# EAGLE design B602A (EAGLE 6.6.0)
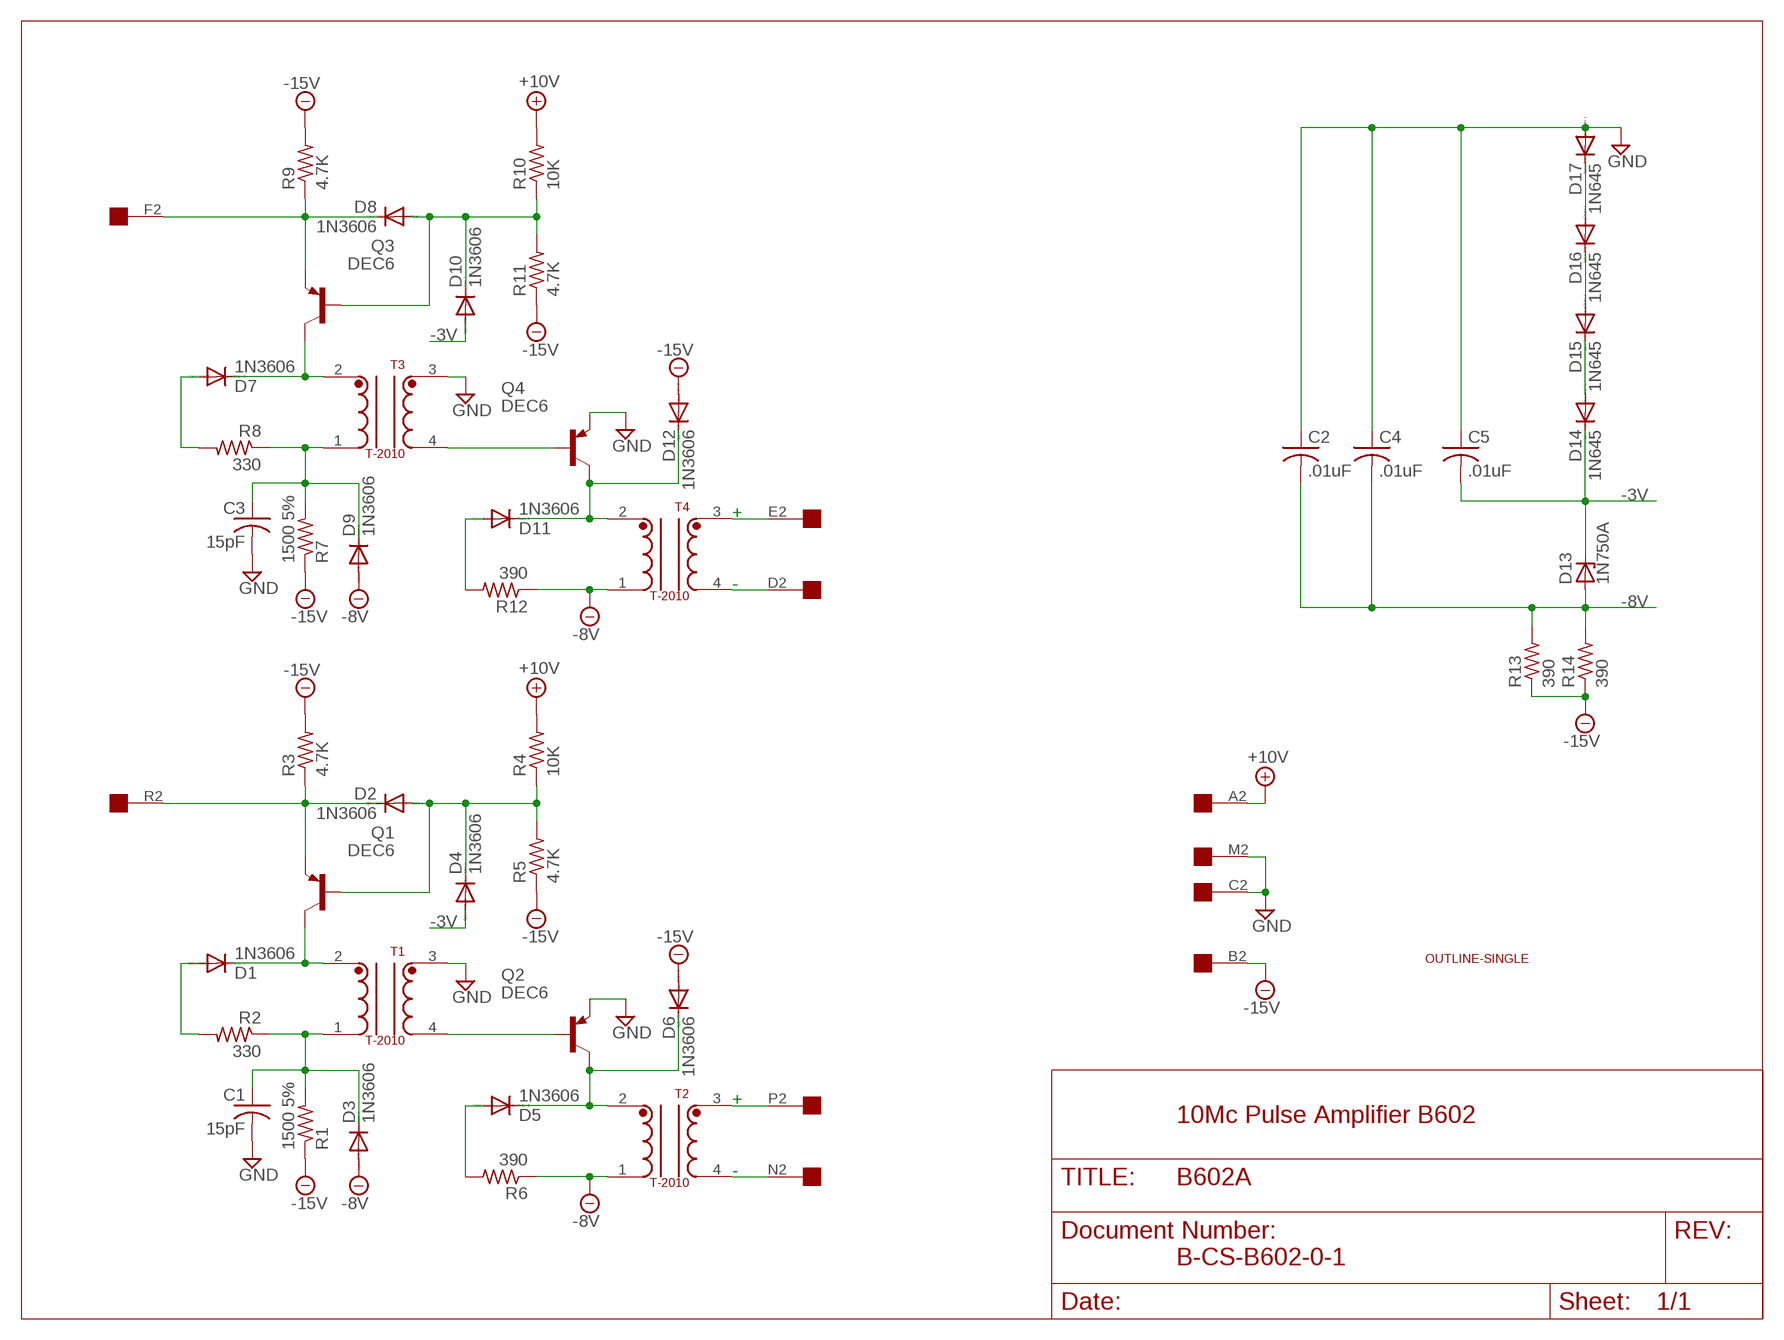
[diagram p0: schematic, sheet 1]

## Parts
C1  15pF  C-US050-025X075  [C050-025X075]
C2  .01uF  C-US050-025X075  [C050-025X075]
C3  15pF  C-US050-025X075  [C050-025X075]
C4  .01uF  C-US050-025X075  [C050-025X075]
C5  .01uF  C-US050-025X075  [C050-025X075]
D1  1N3606  1N4148DO35-10  [DO35-10]
D2  1N3606  1N4148DO35-10  [DO35-10]
D3  1N3606  1N4148DO35-10  [DO35-10]
D4  1N3606  1N4148DO35-10  [DO35-10]
D5  1N3606  1N4148DO35-10  [DO35-10]
D6  1N3606  1N4148DO35-10  [DO35-10]
D7  1N3606  1N4148DO35-10  [DO35-10]
D8  1N3606  1N4148DO35-10  [DO35-10]
D9  1N3606  1N4148DO35-10  [DO35-10]
D10  1N3606  1N4148DO35-10  [DO35-10]
D11  1N3606  1N4148DO35-10  [DO35-10]
D12  1N3606  1N4148DO35-10  [DO35-10]
D13  1N750A  ZENER-DIODEDO35Z10  [DO35Z10]
D14  1N645  1N4148DO35-10  [DO35-10]
D15  1N645  1N4148DO35-10  [DO35-10]
D16  1N645  1N4148DO35-10  [DO35-10]
D17  1N645  1N4148DO35-10  [DO35-10]
Q1  DEC6  2N2904  [TO39]
Q2  DEC6  2N2904  [TO39]
Q3  DEC6  2N2904  [TO39]
Q4  DEC6  2N2904  [TO39]
R1  1500 5%  R-US_0207/10  [0207/10]
R2  330  R-US_0207/10  [0207/10]
R3  4.7K  R-US_0207/10  [0207/10]
R4  10K  R-US_0207/10  [0207/10]
R5  4.7K  R-US_0207/10  [0207/10]
R6  390  R-US_0207/10  [0207/10]
R7  1500 5%  R-US_0207/10  [0207/10]
R8  330  R-US_0207/10  [0207/10]
R9  4.7K  R-US_0207/10  [0207/10]
R10  10K  R-US_0207/10  [0207/10]
R11  4.7K  R-US_0207/10  [0207/10]
R12  390  R-US_0207/10  [0207/10]
R13  390  R-US_0207/10  [0207/10]
R14  390  R-US_0207/10  [0207/10]
T1  T-2010  [TRANSFORMER2]
T2  T-2010  [TRANSFORMER2]
T3  T-2010  [TRANSFORMER2]
T4  T-2010  [TRANSFORMER2]
U$1  OUTLINE-SINGLE  [SINGLE]
U$2  EDGE-1  [EDGE-CON1]

## Nets
+10V [Supply]: R4.2 R10.2 U$2.A2
-3V [Supply]: C5.2 D4.A D10.A D13.C D14.C
-8V: C2.2 C4.2 D3.A D9.A D13.A R6.1 R12.1 R13.2 R14.2 T2.1 T4.1
-15V [Supply]: D6.A D12.A R1.1 R3.2 R5.1 R7.1 R9.2 R11.1 R13.1 R14.1 U$2.B2
GND [Supply]: C1.2 C2.1 C3.2 C4.1 C5.1 D17.A Q2.1(E) Q4.1(E) T1.3 T3.3 U$2.C2 U$2.M2
N$1: D7.C Q3.3(C) T3.2
N$2: D7.A R8.2
N$3: T2.3 U$2.P2
N$4: T2.4 U$2.N2
N$5: T4.3 U$2.E2
N$6: D5.C D6.C Q2.3(C) T2.2
N$7: T4.4 U$2.D2
N$8: Q2.2(B) T1.4
N$9: D1.C Q1.3(C) T1.2
N$10: D5.A R6.2
N$11: D11.C D12.C Q4.3(C) T4.2
N$12: D11.A R12.2
N$13: D1.A R2.2
N$14: C1.1 D3.C R1.2 R2.1 T1.1
N$15: Q4.2(B) T3.4
N$16: C3.1 D9.C R7.2 R8.1 T3.1
N$17: D2.C Q1.1(E) R3.1 U$2.R2
N$18: D8.C Q3.1(E) R9.1 U$2.F2
N$19: D2.A D4.C Q1.2(B) R4.1 R5.2
N$20: D8.A D10.C Q3.2(B) R10.1 R11.2
N$26: D16.A D17.C
N$27: D15.A D16.C
N$29: D14.A D15.C
Unconnected: U$2.H2 U$2.J2 U$2.K2 U$2.L2 U$2.S2 U$2.T2 U$2.U2 U$2.V2

## Notes on the sheet
- +
- -
- +
- 10Mc Pulse Amplifier B602
- -
- B-CS-B602-0-1

## Library data of the parts
C1-C5 = rcl:C-US: CAPACITOR, American symbol
D1-D12 D14-D17 = diode:1N4148: DIODE high speed (Philips)
D13 = diode:ZENER-DIODE: Z-Diode
Q1-Q4 = transistor-pnp:2N2904*: PNP Transistror
R1-R14 = rcl:R-US_: RESISTOR, American symbol
T1-T4 = dec-con:T-2010: Button Transformer
U$1 = dec-con:OUTLINE-*: Board outlines for DEC boards.
U$2 = dec-con:EDGE-1: Single-Sided DEC Edge Connector -- (side 2)

## Net classes
1 Supply: width 0.813 mm

## Board
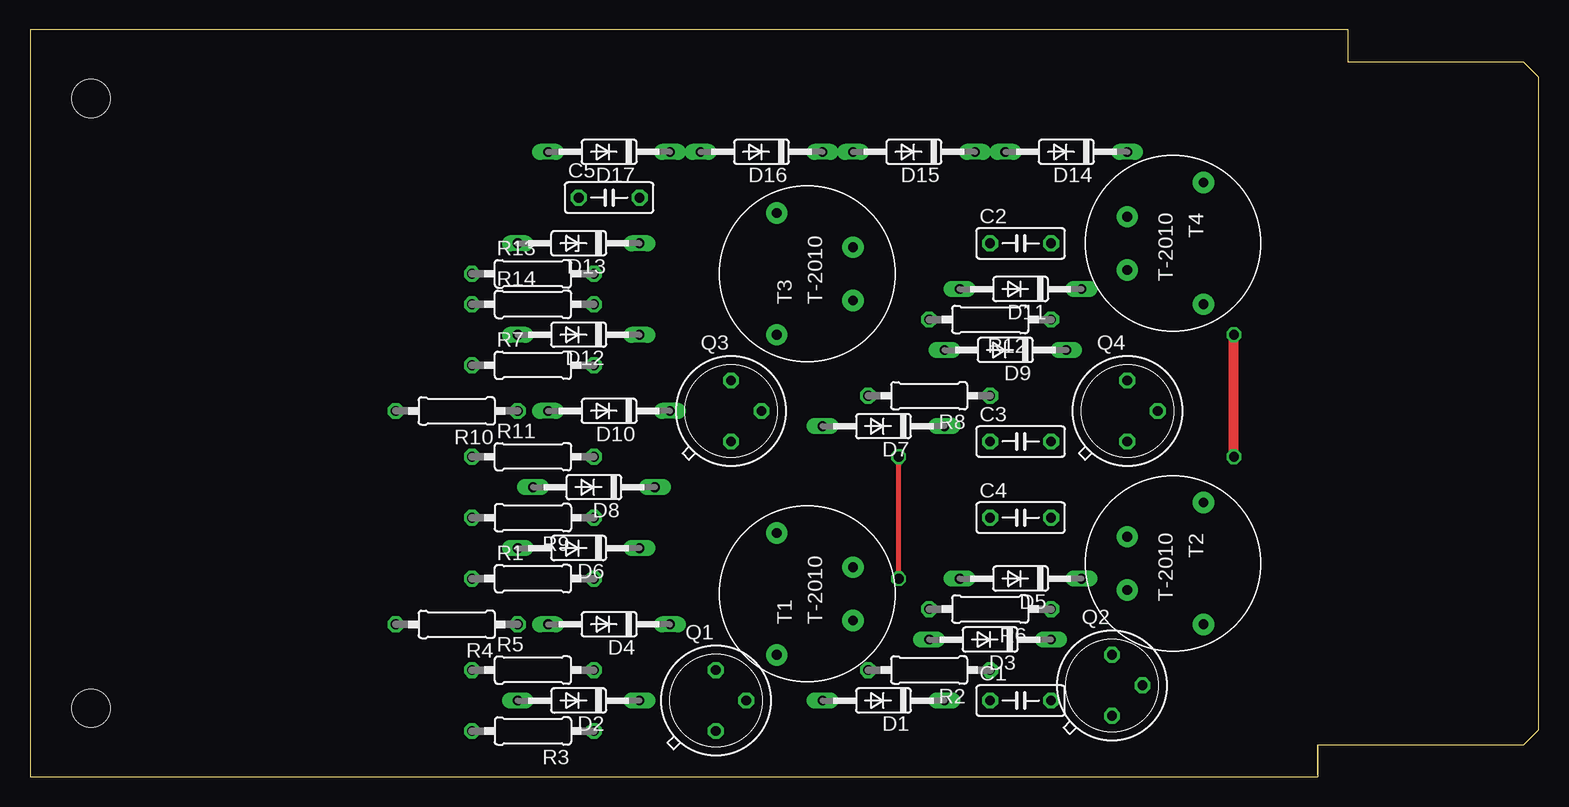
[diagram p1: board, top side]
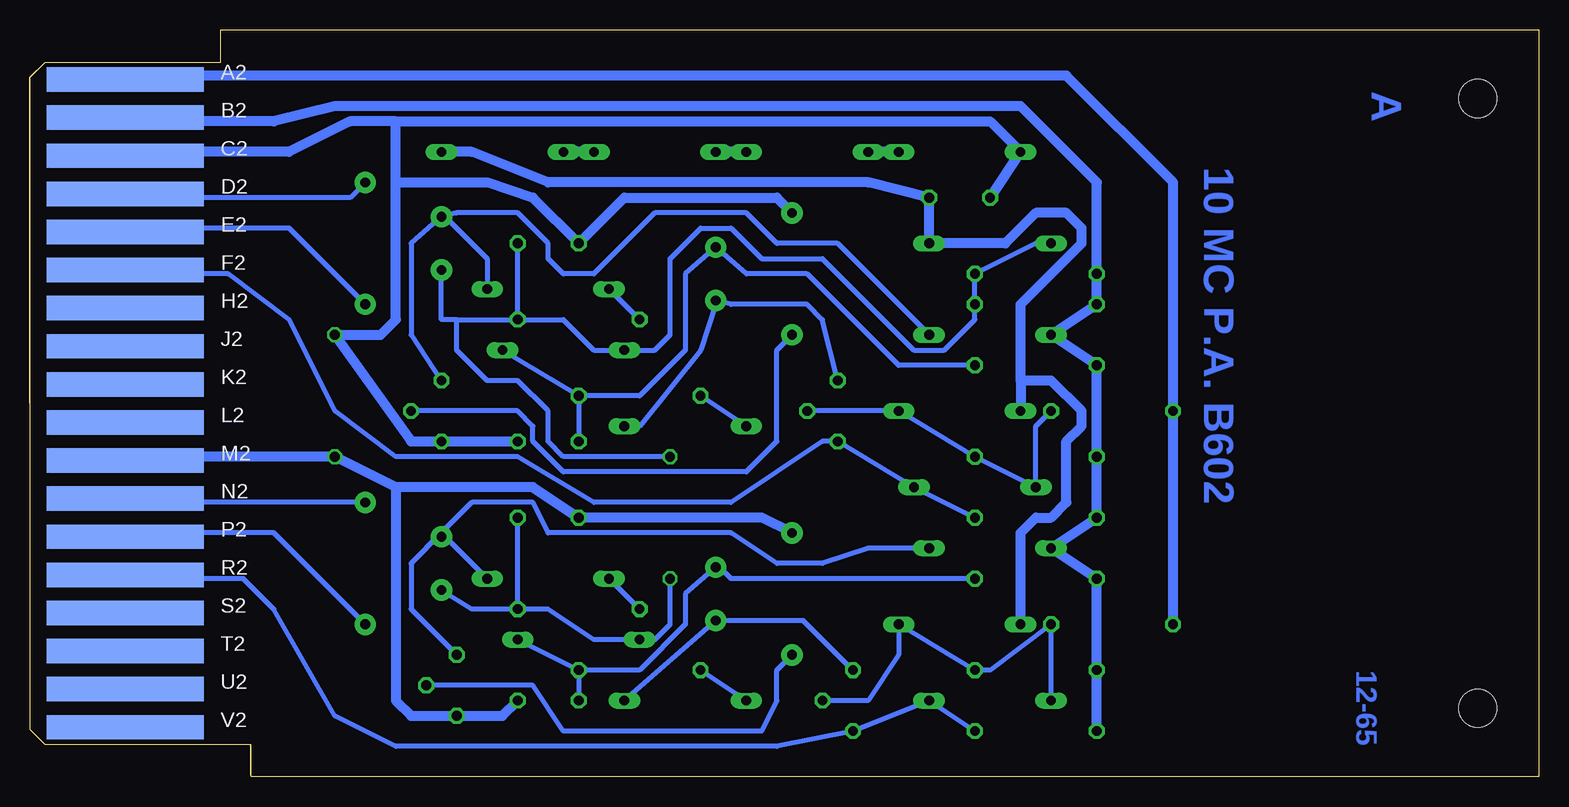
[diagram p2: board, bottom side, seen from below]

Size 125.73 x 62.23 mm. Coordinates in mm from the lower left corner, seen from the top.
Copper layers (1+16): Top 0.035mm / dielectric 1.5mm / Bottom 0.035mm
Design rules "16mils": minimum track width 16mil, minimum drill 32mil, track to track 15mil, track to pad 10mil, pad to pad 10mil, via to via 10mil, smd to smd 10mil, copper to edge 13mil, drill to drill 10mil, minimum pad ring 10mil, minimum via ring 8mil, stop-mask expansion 0mil, vias tented up to drill 0mil, thermal gap 10mil

### Footprints (pad centres in the part's own frame; a part is rotated, then mirrored left to right if it is on the bottom)
C050-025X075 = drill 0.813 octagon: 1 -2.54,0; 2 2.54,0
DO35-10 = drill 0.813 long: A 5.08,0; C -5.08,0
DO35Z10 = drill 0.813 long: A 5.08,0; C -5.08,0
TO39 = drill 0.813 octagon: 1 0,-2.54; 2 2.54,0; 3 0,2.54
0207/10 = drill 0.813 octagon: 1 -5.08,0; 2 5.08,0
TRANSFORMER2 = drill 0.813 pad 1.778: 1 2.223,-3.81; 2 -2.223,-3.81; 3 5.08,2.54; 4 -5.08,2.54
SINGLE = hole 3.175: 120.65,56.515; 120.65,5.715
EDGE-CON1 = smd 13.106 x 2.032 bottom: A2 7.938,4.128; B2 7.938,7.303; C2 7.938,10.477; D2 7.938,13.652; E2 7.938,16.828; F2 7.938,20.003; H2 7.938,23.177; J2 7.938,26.352; K2 7.938,29.527; L2 7.938,32.703; M2 7.938,35.877; N2 7.938,39.053; P2 7.938,42.227; R2 7.938,45.403; S2 7.938,48.578; T2 7.938,51.752; U2 7.938,54.928; V2 7.938,58.102

### Placement (x,y rotation side)
C1  82.55,6.35 0 top
C2  82.55,44.45 0 top
C3  82.55,27.94 0 top
C4  82.55,21.59 0 top
C5  48.26,48.26 0 top
D1  71.12,6.35 180 top
D2  45.72,6.35 180 top
D3  80.01,11.43 180 top
D4  48.26,12.7 180 top
D5  82.55,16.51 180 top
D6  45.72,19.05 180 top
D7  71.12,29.21 180 top
D8  46.99,24.13 180 top
D9  81.28,35.56 180 top
D10  48.26,30.48 180 top
D11  82.55,40.64 180 top
D12  45.72,36.83 180 top
D13  45.72,44.45 180 top
D14  86.36,52.07 180 top
D15  73.66,52.07 180 top
D16  60.96,52.07 180 top
D17  48.26,52.07 180 top
Q1  57.15,6.35 0 top
Q2  90.17,7.62 0 top
Q3  58.42,30.48 0 top
Q4  91.44,30.48 0 top
R1  41.91,16.51 0 top
R2  74.93,8.89 180 top
R3  41.91,3.81 180 top
R4  35.56,12.7 180 top
R5  41.91,8.89 0 top
R6  80.01,13.97 180 top
R7  41.91,34.29 0 top
R8  74.93,31.75 180 top
R9  41.91,21.59 180 top
R10  35.56,30.48 180 top
R11  41.91,26.67 0 top
R12  80.01,38.1 180 top
R13  41.91,41.91 0 top
R14  41.91,39.37 0 top
T1  64.77,15.24 90 top
T2  95.25,17.78 270 top
T3  64.77,41.91 90 top
T4  95.25,44.45 270 top
U$1  125.73,62.23 180 top
U$2  125.73,62.23 180 top

### Tracks (layer width: path | path; a pad name or v marks a point on that pad's centre or on a via)
+10V
  Bottom 0.813: U$2.A2 117.22,58.04 116.84,58.42 39.37,58.42 30.48,49.53 R10.2 R4.2
-3V
  Bottom 0.813: D14.C 88.9,52.07 82.55,49.53 55.88,49.53 C5.2 D13.C 44.45,44.45 41.91,46.99 39.37,46.99 38.1,45.72 38.1,44.45 43.18,39.37 43.18,33.02 | 43.18,33.02 D10.A | D4.A 43.18,20.32 41.91,21.59 40.64,21.59 39.37,22.86 39.37,27.94 38.1,29.21 38.1,30.48 40.64,33.02 43.18,33.02
-8V  (via drill 0.81)
  Top 0.406: v72.39,16.51 v72.39,26.67
  Bottom 0.406: D13.A 41.91,44.45 R13.2 R14.2 46.99,38.1 49.53,35.56 52.07,35.56 59.69,43.18 64.77,43.18 67.31,45.72 69.85,45.72 72.39,43.18 72.39,36.83 73.66,35.56 D9.A 78.74,35.56 81.28,38.1 R12.1 | 90.17,38.1 R12.1 | 90.17,38.1 91.44,38.1 T4.1 | 90.17,38.1 90.17,35.56 87.63,33.02 85.09,33.02 82.55,30.48 82.55,27.94 81.28,26.67 v72.39,26.67 | T2.1 88.9,13.97 R6.1 | R6.1 C4.2 | R6.1 82.55,13.97 78.74,11.43 D3.A 73.66,11.43 72.39,12.7 v72.39,16.51 | R12.1 C2.2
-15V
  Bottom 0.813: U$2.B2 117.13,54.9 116.84,54.61 105.41,54.61 100.33,55.88 43.18,55.88 36.83,49.53 R13.1 R14.1 D12.A R7.1 R11.1 R9.2 D6.A R1.1 R5.1 R3.2
GND  (via drill 0.81)
  Top 0.813: v100.33,26.67 v100.33,36.83
  Bottom 0.813: U$2.C2 117.17,51.74 116.84,52.07 104.14,52.07 99.06,54.61 95.25,54.61 | 95.25,54.61 45.72,54.61 D17.A C5.1 | T3.3 63.5,48.26 76.2,48.26 C2.1 83.82,48.26 87.63,49.53 95.25,49.53 | 95.25,49.53 95.25,54.61 | U$2.M2 116.84,26.67 v100.33,26.67 95.25,24.13 | 95.25,24.13 83.82,24.13 C4.1 64.77,21.59 T1.3 | 95.25,24.13 95.25,6.35 93.98,5.08 Q2.1 86.36,5.08 C1.2 | 93.98,27.94 Q4.1 | 93.98,27.94 v100.33,36.83 96.52,36.83 95.25,38.1 95.25,49.53 | 93.98,27.94 C3.2
N$1
  Bottom 0.406: Q3.3 59.69,38.1 60.96,39.37 67.31,39.37 68.5,39.67 | 68.5,39.67 T3.2 | D7.C 74.93,29.21 69.85,35.56 68.58,39.37 68.5,39.67
N$2
  Bottom 0.406: D7.A R8.2
N$3
  Bottom 0.406: U$2.P2 117.17,19.99 116.84,20.32 105.41,20.32 T2.3
N$4
  Bottom 0.406: U$2.N2 117.17,23.19 116.84,22.86 T2.4
N$5
  Bottom 0.406: U$2.E2 117.17,45.39 116.84,45.72 104.14,45.72 T4.3
N$6
  Bottom 0.406: Q2.3 93.98,13.97 93.98,17.78 91.44,20.32 | 91.44,20.32 T2.2 | D6.C 55.88,19.05 59.69,17.78 63.5,17.78 67.31,20.32 82.55,20.32 83.82,22.86 88.9,22.86 91.44,20.32 | 91.44,20.32 D5.C
N$7
  Bottom 0.406: U$2.D2 117.14,48.56 116.84,48.26 99.06,48.26 T4.4
N$8
  Bottom 0.406: Q2.2 83.82,7.62 81.28,3.81 64.77,3.81 63.5,6.35 63.5,8.89 T1.4
N$9
  Bottom 0.406: Q1.3 61.28,13.02 T1.2 D1.C
N$10
  Bottom 0.406: R6.2 D5.A
N$11
  Bottom 0.406: 91.36,46.69 90.17,46.99 85.09,46.99 82.55,44.45 82.55,43.18 81.28,41.91 78.74,41.91 73.66,46.99 66.04,46.99 63.5,44.45 58.42,44.45 D12.C | 91.36,46.69 T4.2 93.98,44.45 93.98,36.83 Q4.3 | D11.C 87.63,43.18 91.44,46.99 91.36,46.69
N$12
  Bottom 0.406: R12.2 D11.A
N$13
  Bottom 0.406: D1.A R2.2
N$14
  Bottom 0.406: R1.2 67.31,16.51 68.26,17.46 T1.1 71.12,15.24 71.12,12.7 74.93,8.89 R2.1 | R2.1 C1.1 | R2.1 D3.C
N$15
  Bottom 0.406: Q4.2 85.09,30.48 83.82,29.21 83.82,27.94 81.28,25.4 66.04,25.4 63.5,27.94 63.5,35.56 T3.4
N$16
  Bottom 0.406: R8.1 C3.1 | R8.1 74.93,31.75 71.12,35.56 71.12,41.91 T3.1 66.04,41.91 60.96,41.91 53.34,34.29 R7.2 | R8.1 D9.C
N$17
  Bottom 0.406: R3.1 D2.C Q1.1 63.5,2.54 95.25,2.54 100.33,5.08 105.41,13.97 107.95,16.51 116.84,16.51 U$2.R2
N$18
  Bottom 0.406: U$2.F2 116.84,41.91 109.22,41.91 104.14,38.1 100.33,30.48 95.25,26.67 85.09,26.67 78.74,22.86 67.31,22.86 59.69,27.94 Q3.1 D8.C R9.1
N$19
  Bottom 0.406: Q1.2 55.88,6.35 53.34,10.16 D4.C R5.2 45.72,8.89 R4.1 D2.A
N$20
  Bottom 0.406: R10.1 41.91,29.21 D8.A R11.2 D10.C Q3.2
N$26
  Bottom 0.813: D17.C D16.A
N$27
  Bottom 0.813: D16.C D15.A
N$29
  Bottom 0.813: D15.C D14.A

### Text on the board
Bottom: A | 10 MC P.A. B602 | 12-65